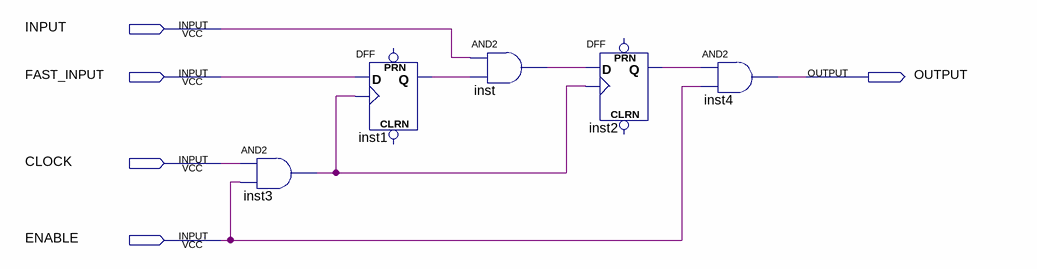
[diagram p0: schematic sheet]
// Quartus schematic TimingCompitoB.bdf as structural Verilog: 5 symbols, 5 pins
module TimingCompitoB (
  input  INPUT,
  input  FAST_INPUT,
  input  CLOCK,
  input  ENABLE,
  output OUTPUT
);

  wire inst1_q, inst2_q, inst3_out, inst_out;

  and inst3 (inst3_out, CLOCK, ENABLE);
  DFF inst1 (.CLK(inst3_out), .D(FAST_INPUT), .Q(inst1_q));  // open: CLRN, PRN
  and inst (inst_out, INPUT, inst1_q);
  DFF inst2 (.CLK(inst3_out), .D(inst_out), .Q(inst2_q));  // open: CLRN, PRN
  and inst4 (OUTPUT, inst2_q, ENABLE);
endmodule
